# Altium schematic sheet Sheet1new.SchDoc
size A2
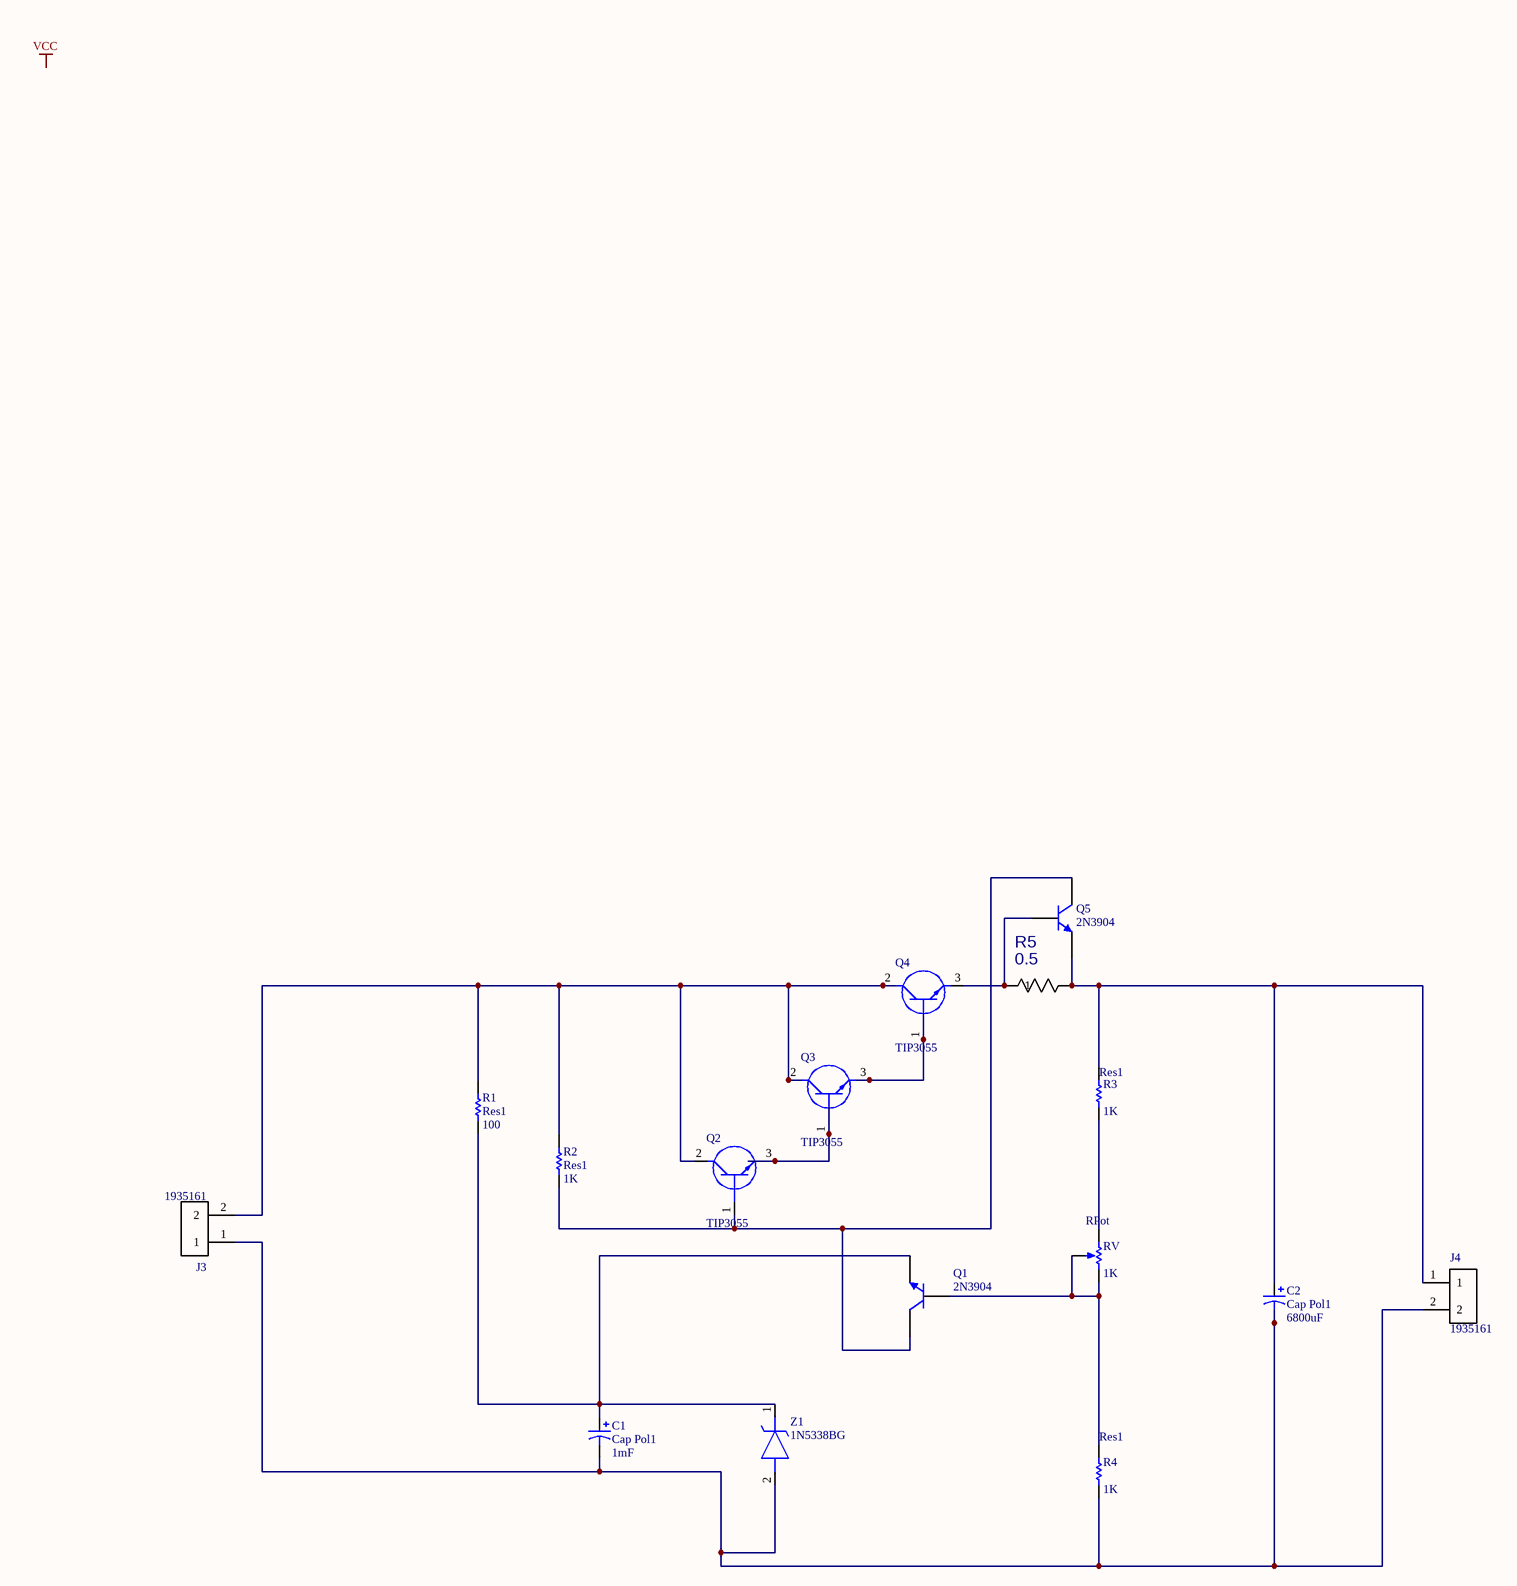
[diagram p0: Sheet1new.SchDoc]

## Parts
C1  Cap Pol1  value 1mF  [RB7.6-15]
C2  Cap Pol1  value 6800uF  [RB7.6-15]
J3  1935161  [*PHOENIX_1935161]
J4  1935161  [*PHOENIX_1935161]
Q1  2N3904  [TO-92A]
Q2  TIP3055  [TO545P515X1560X2445-3P]
Q3  TIP3055  [TO545P515X1560X2445-3P]
Q4  TIP3055  [TO545P515X1560X2445-3P]
Q5  2N3904  [TO-92A]
R1  Res1  value 100  [AXIAL-0.3]
R2  Res1  value 1K  [AXIAL-0.3]
R3  Res1  value 1K  [AXIAL-0.3]
R4  Res1  value 1K  [AXIAL-0.3]
R5  value 0.5  [RES_TK]  (hidden comment: TK20PR050JE)
RV  RPot  value 1K  [VR5]
Z1  1N5338BG  [DIOAD2260W109L864D349]

## Nets
NetC1_1: C1.1 Q1.1(E) R1.1 Z1.1(A)
NetC1_2: C1.2 C2.2 J3.1 J4.2 R4.1 Z1.2(K)
NetC2_1: C2.1 J4.1 Q5.1(E) R3.2 R5.2
NetJ3_2: J3.2 Q2.2(C) Q3.2(C) Q4.2(C) R1.2 R2.2
NetQ1_2: Q1.2(B) R4.2 RV.2(BOT) RV.3(TAP)
NetQ1_3: Q1.3(C) Q2.1(B) Q5.3(C) R2.1
NetQ2_3: Q2.3(E) Q3.1(B)
NetQ3_3: Q3.3(E) Q4.1(B)
NetQ4_3: Q4.3(E) Q5.2(B) R5.1
NetR3_1: R3.1 RV.1(TOP)

## Notes on the sheet
- Labels drawn without touching a wire or pin: VCC

## Library data of the parts
C1 C2 = Cap Pol1: Polarized Capacitor (Radial); Published: 8-Jun-2000; LatestRevisionDate: 17-Jul-2002; LatestRevisionNote: Re-released for DXP Platform.; PackageReference: RB7.6-15; Publisher: Altium Limited; PackageDescription: Polarized Capacitor (Radial); 2 Leads
J3 J4 = 1935161: Conn Terminal Blocks 2 POS 5mm Solder ST Thru-Hole 16A; MF: Phoenix Contact; SnapEDA_Link: https://www.snapeda.com/parts/1935161/Phoenix%20Contact/view-part/?ref=snap; Availability: Unavailable; Package: None; Price: None; MP: 1935161; Value: *
Q1 Q5 = 2N3904: NPN General Purpose Amplifier; Published: 8-Jun-2000; LatestRevisionDate: 15-Jan-2003; LatestRevisionNote: PCB Footprint 'BCY-W3/D4.7' replaced; DatasheetVersion: 1997; PackageVersion: Sep-1998; PackageReference: TO-92A; Publisher: Altium Limited; PackageDescription: TO, Flat Index; 3 In-Line, Axial Leads; Body Dia. 4.5mm; Leads 0.51 x 0.48 mm (max); ComponentLink1Description: Manufacturer Link; ComponentLink1URL: http://www.fairchildsemi.com/; ComponentLink2Description: Datasheet; ComponentLink2URL: http://www.fairchildsemi.com/ds/2N%2F2N3904.pdf
Q2-Q4 = TIP3055: Transistor BJT NPN; Manufacturer_Name: STMicroelectronics; Allied_Number: 70014122; Datasheet Link: http://www.st.com/web/en/resource/technical/document/datasheet/CD00000918.pdf; Height: 5.15mm; Manufacturer_Part_Number: TIP3055; Mouser Part Number: 511-TIP3055; Mouser Price/Stock: https://www.mouser.com/Search/Refine.aspx?Keyword=511-TIP3055; RS Part Number: 1686168; RS Price/Stock: http://uk.rs-online.com/web/p/products/1686168; Allied Price/Stock: http://www.alliedelec.com/stmicroelectronics-tip3055/70014122/
R1-R4 = Res1: Resistor; Published: 8-Jun-2000; LatestRevisionDate: 17-Jul-2002; LatestRevisionNote: Re-released for DXP Platform.; PackageReference: AXIAL-0.3; Publisher: Altium Limited; PackageDescription: Axial Device, Thru-Hole; 2 Leads; 0.3 in Pin Spacing
R5 = TK20PR050JE: C: Copyright (C) 2015 Accelerated Designs. All rights reserved; Vendor: Ohmite; Built_By: EMA_UL_Team; Manufacturer_Part_Number: TK20PR050JE
RV = RPot: Potentiometer; Sim Note: Enter the Resistance value and the set point into parameter fields.; Set Position: 0.5; Published: 8-Jun-2000; LatestRevisionDate: 17-Jul-2002; LatestRevisionNote: Re-released for DXP Platform.; PackageReference: VR5; Publisher: Altium Limited; PackageDescription: Variable Resistor, Thru-Hole; 3 Leads
Z1 = 1N5338BG: Zener Diode; Manufacturer_Name: ON Semiconductor; Allied_Number: 70099695; Datasheet Link: http://docs-emea.rs-online.com/webdocs/1385/0900766b813857e1.pdf; Manufacturer_Part_Number: 1N5338BG; Mouser Part Number: 863-1N5338BG; Mouser Price/Stock: https://www.mouser.com/Search/Refine.aspx?Keyword=863-1N5338BG; RS Part Number: 0463274P; RS Price/Stock: http://uk.rs-online.com/web/p/products/0463274P; Allied Price/Stock: http://www.alliedelec.com/on-semiconductor-1n5338bg/70099695/